# Altium schematic sheet Power_1.SchDoc
size 177 x 127 mm; SheetNumber: 1; SheetTotal: 6
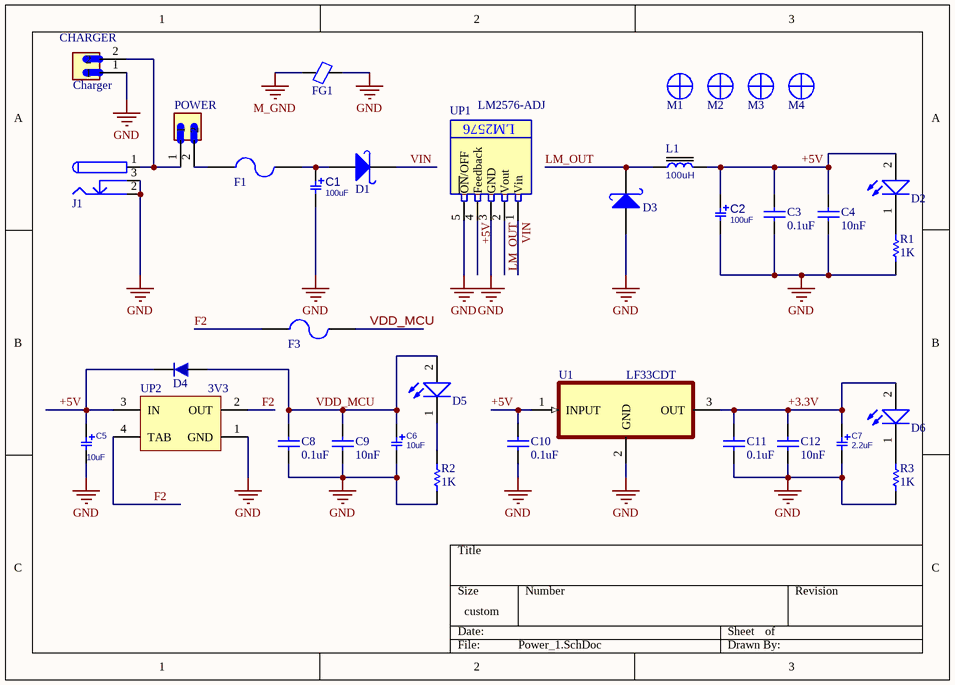
[diagram p0: Power_1.SchDoc]

## Parts
C1  100uF  [C_EL_10_10]
C2  100uF  [C_EL_10_10]
C3  0.1uF  [CAPC3413X12N]
C4  10nF  [CAPC3413X12N]
C5  10uF  [C_TN_6032]
C6  10uF  [C_TN_6032]
C7  2.2uF  [C_TN_6032]
C8  0.1uF  [CAPC3413X12N]
C9  10nF  [CAPC3413X12N]
C10  0.1uF  [CAPC3413X12N]
C11  0.1uF  [CAPC3413X12N]
C12  10nF  [CAPC3413X12N]
CHARGER  Charger  [JST_B2P-VH(LF)(SN)]
D1  1n5822  [DO-214AB(SMC)]  (value not drawn)
D2  LED SMD PACKAGE  [LED_SMD_0805]  (value not drawn)
D3  1n5822  [DO-214AB(SMC)]  (value not drawn)
D4  1n4007  [DIOM4629X24N]  (value not drawn)
D5  LED SMD PACKAGE  [LED_SMD_0805]  (value not drawn)
D6  LED SMD PACKAGE  [LED_SMD_0805]  (value not drawn)
F1  F=3A  [1206 FUSE]  (value not drawn)
F3  F=3A  [1206 FUSE]  (value not drawn)
FG1  Ferrite Bead SMD  [FB0805]  (value not drawn)
J1  DC Power Jack  [DC Power Jack 1]  (value not drawn)
L1  100uH  [L_12]
M1  Screw  [Board Screw 3mm]  (value not drawn)
M2  Screw  [Board Screw 3mm]  (value not drawn)
M3  Screw  [Board Screw 3mm]  (value not drawn)
M4  Screw  [Board Screw 3mm]  (value not drawn)
POWER  B2P-VH(LF)(SN)  [JST_B2P-VH(LF)(SN)]  (value not drawn)
R1  1K  [RESC3413X04N]
R2  1K  [RESC3413X04N]
R3  1K  [RESC3413X04N]
U1  LF33CDT  [TO228P972X240-3N]
UP1  LM2576-ADJ  [LM2576 SMD]
UP2  3V3  [SOT223]

## Nets
GND: C1.2 C2.2 C3.1 C4.1 C5.2 C6.2 C7.2 C8.1 C9.1 C10.1 C11.1 C12.1 CHARGER.1 D3.1(A) FG1.2 J1.2 J1.3 R1.1 R2.1 R3.1 U1.2(GND) UP1.3(GND) UP1.5(~{ON}/OFF) UP2.1(GND)
M_GND: FG1.1
+3.3V: C7.1 C11.2 C12.2 D6.2(A) U1.3(OUT)
+5V: C2.1 C3.2 C4.2 C5.1 C10.2 D2.2(A) D4.2 L1.2 U1.1(INPUT) UP1.4(Feedback) UP2.3(IN)
F2: F3.1 UP2.2(OUT) UP2.4(TAB)
LM_OUT: D3.2(K) L1.1 UP1.2(Vout)
VDD_MCU: C6.1 C8.2 C9.2 D4.1 D5.2(A) F3.2
VIN: D1.2(K) UP1.1(Vin)
NetC1_1: C1.1 D1.1(A) F1.2
NetCHARGER_2: CHARGER.2 J1.1 POWER.1
NetD2_1: D2.1(K) R1.2
NetD5_1: D5.1(K) R2.2
NetD6_1: D6.1(K) R3.2
NetF1_1: F1.1 POWER.2

## Notes on the sheet
- (in symbol LM2576-Adj) LM2576

## Library data of the parts
C1 C2 = CAP_SMD_EL: CAP, THD, ELEC,; MANF_P#: MANF_PART#; PARAM2: 20%; DESC: DESCRIPTION; DIST#: MOUSER; PARAM: 25V; PRICE: 10= 5$; MANF: MANF; ASSEMBLY: ASSEMBLY; VALUE: 100uF
C3 C4 C8-C12 = CAP SMD 0805: CAP 0805; Designer: Abbas Basereh; Desc.: CAP SMD 0805; Data: 16-12-2016
C5-C7 = CAP_SMD_TAN: CAP, SMD, TAN,; PARAM: 25V
  C5 C6: VALUE: 10uF
  C7: VALUE: 2.2uF
CHARGER POWER = B2P-VH(LF)(SN): Connector Header Through Hole 2 position 0.156 (3.96mm); MF: JST Sales; Price: None; Availability: In Stock; Package: None; MP: B2P-VH(LF)(SN); Value: *; SnapEDA_Link: https://www.snapeda.com/parts/B2P-VH(LF)(SN)/JST+Sales+America+Inc./view-part/?ref=snap; Purchase-URL: https://pricing.snapeda.com/search/part/B2P-VH(LF)(SN)/?ref=eda; Check_prices: https://www.snapeda.com/parts/B2P-VH(LF)(SN)/JST+Sales+America+Inc./view-part/?ref=eda
D1 D3 = 1N5822 SMD: Schottky Rectifiers; Part. No: SS34; Manufacturer: ON Semiconductor/Fairchild; Designer: Abbas Basereh; Link: https://www.aliexpress.com/item/Free-shipping-100pcs-1n5822-sma-smd-do-214ac-Schottky-diode-ss34/32337482329.html?spm=2114.01010208.3.1.zLZDsP&ws_ab_test=searchweb0_0,searchweb201602_4_10065_10068_10084_10083_10080_10082_10081_10060_10061_10062_10056_10055_10054_10059_10099_10078_10079_427_10073_10103_10102_10096_10052_10050_10051,searchweb201603_4&btsid=6e50dc92-ac69-45bc-a19e-209af19ce602; Link: http://www.tme.eu/en/details/ss34/smd-schottky-diodes/vishay/ss34-e357t/; Link: http://www.digikey.com/product-detail/en/on-semiconductor-fairchild/SS34/SS34FSCT-ND/2094459; Data: 16-12-2016
D2 D5 D6 = LED SMD PACKAGE: SMD Mono-color Chip LED Waterclear; Part Number: 150080BS75000; Peak Wavelength: 465 nm; Forward Voltage: 3.2 V; Published Date: Jan 2017; Publisher: Ali Hafizi
D4 = 1n4007 SMD M7: Standard Rectifiers; Part. No: M7; Manufacturer: DC COMPONENTS; Designer: Abbas Basereh; Link: http://www.tme.eu/en/details/m7/smd-universal-diodes/dc-components/; Link: https://www.aliexpress.com/item/Smd-tube-1n4007-m7-SMA/1213719741.html?spm=2114.01010208.3.1.ZyZ7bC&ws_ab_test=searchweb0_0,searchweb201602_4_10065_10068_10084_10083_10080_10082_10081_10060_10061_10062_10056_10055_10054_10059_10099_10078_10079_427_10073_10103_10102_10096_10052_10050_10051,searchweb201603_4&btsid=db2be5ca-e560-400a-b91c-484ab5ee228b; Data: 16-12-2016
F1 F3 = Fuse SMD1206: SMD Fuses 1206; Designer: Abbas Basereh; Desc.: SMD Fuses 1206; Data: 16-12-2016
FG1 = Ferrite Bead SMD Package: Designer: Ali Hafizi
J1 = DC Power Jack: DC Power Jack. Center Pin 2.5mm. Diameter: 5.7mm; Designer: Ali Hafizi; Company: Personal; Project Name: Laser; Adding Date: 10/21/2009
L1 = INDPWR_SMD: INDUCTOR, POWER, SMD; VALUE: 100uH
M1-M4 = Board Screw 3MM: Board Screw With Spacer
R1-R3 = RES 0805 0.125W: RES 0805; Designer: Abbas Basereh; Desc.: RES SMD 0805; Data: 16-12-2016
U1 = LF33CDT: Linear Voltage Regulator IC Positive Fixed 1 Output 500mA DPAK; MF: STMicroelectronics; MP: LF33CDT; Price: None; Purchase-URL: https://pricing.snapeda.com/search/part/LF33CDT/?ref=eda; Package: TO-252 STMicroelectronics; Check_prices: https://www.snapeda.com/parts/LF33CDT/STMicroelectronics/view-part/?ref=eda; Value: *; Availability: In Stock; SnapEDA_Link: https://www.snapeda.com/parts/LF33CDT/STMicroelectronics/view-part/?ref=snap
UP1 = LM2576-Adj: 1.2-50V, 3A variable output step-down switching voltage regulator; Designer: Abbas Basereh; Data: 16-12-2016; Link: *; Part.No: *; VALUE: LM2576-ADJ
UP2 = AMS1117-x.x: x.x Volt, 800mA Low-Dropout Linear Regulator, 4-pin SOT-223; Designer: Ali Hafizi; Data: 16-12-2016